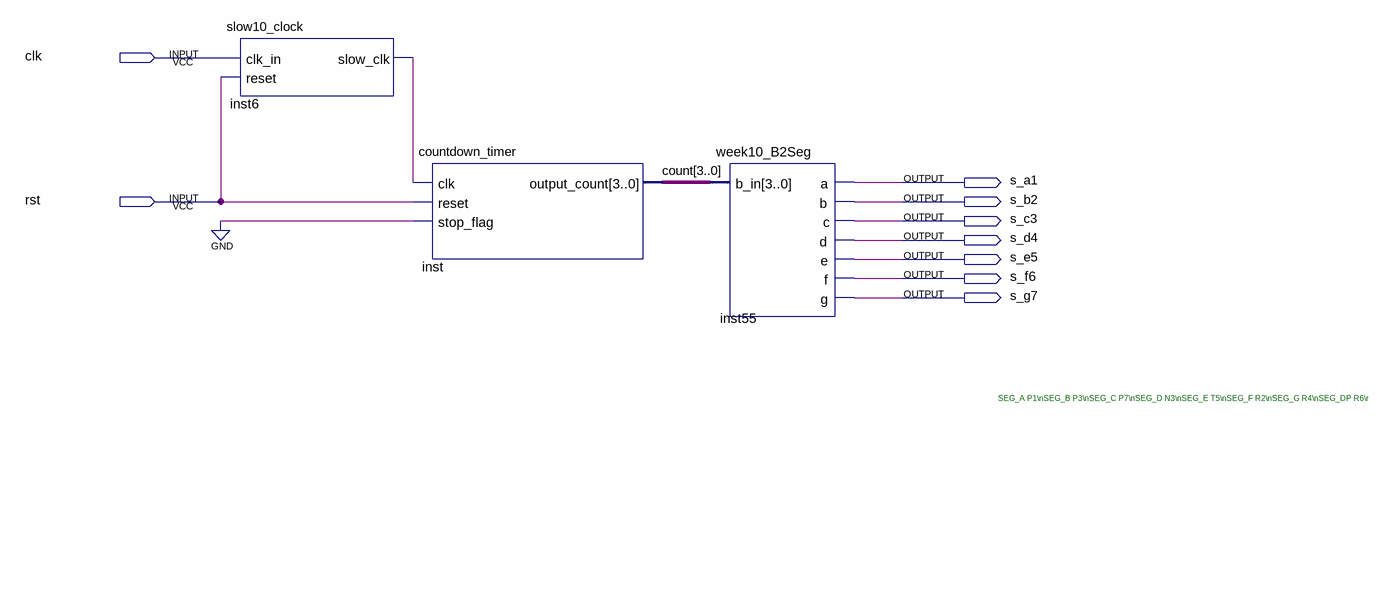
[diagram p0: schematic sheet]
// Quartus schematic Term_countdown.bdf as structural Verilog: 3 symbols, 9 pins
module Term_countdown (
  input  clk,
  input  rst,
  output s_a1,
  output s_b2,
  output s_c3,
  output s_d4,
  output s_e5,
  output s_f6,
  output s_g7
);

  wire inst6_slow_clk;
  wire [3:0] count;

  slow10_clock inst6 (.clk_in(clk), .reset(rst), .slow_clk(inst6_slow_clk));
  countdown_timer inst (.clk(inst6_slow_clk), .reset(rst), .stop_flag(1'b0), .output_count(count));
  week10_B2Seg inst55 (.b_in(count), .a(s_a1), .b(s_b2), .c(s_c3), .d(s_d4), .e(s_e5), .f(s_f6), .g(s_g7));

  // Notes on the sheet:
  //   SEG_A P1\nSEG_B P3\nSEG_C P7\nSEG_D N3\nSEG_E T5\nSEG_F R2\nSEG_G R4\nSEG_DP R6\r
endmodule
